# Altium project AL1000.PrjPcb (part 2 of 2)
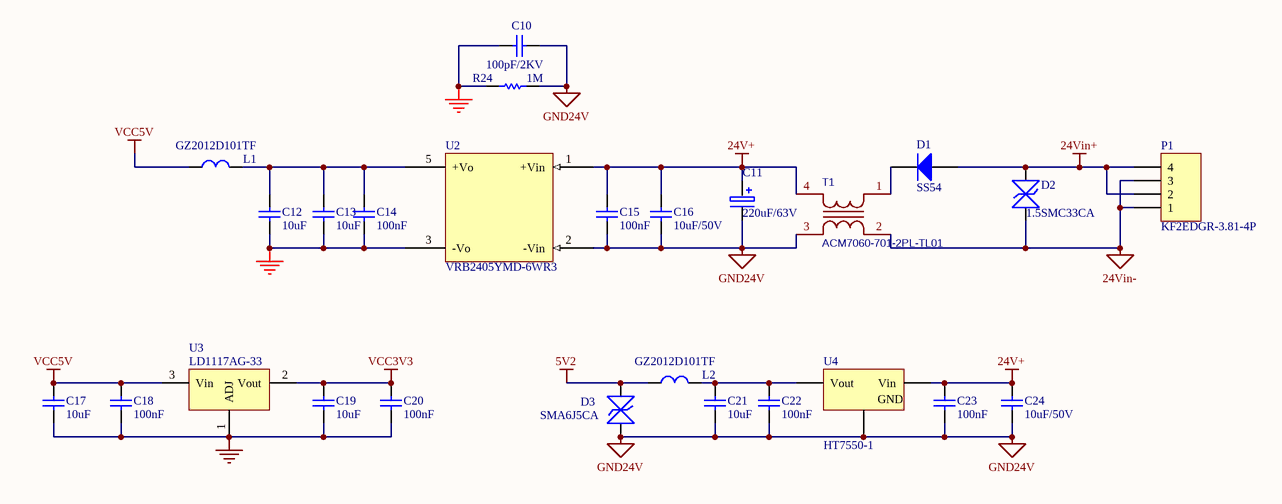
[diagram p7: POWER.SchDoc]

## Nets that join several sheets
5V2: 1 (C49_1.2 U13_1.8), relay (8 pins), POWER (D3.1 L2.2), 3 (C49_3.2 U13_3.8), 2 (C49_2.2 U13_2.8)
24V+: 1 (12 pins), relay (6 pins), POWER (8 pins), 3 (12 pins), 2 (12 pins)
GND: stm32 (34 pins), 1 (12 pins), relay (8 pins), uart (11 pins), EtherNet (16 pins), POWER (11 pins), 3 (12 pins), 2 (12 pins)
GND24V: AL1000 (18 pins), 1 (33 pins), relay (37 pins), uart (6 pins), EtherNet (P11.13 P11.14), POWER (13 pins), 3 (33 pins), 2 (33 pins)
VCC3V3: stm32 (25 pins), 1 (C48_1.2 L5_1.1 U13_1.1 U15_1.1), relay (10 pins), uart (5 pins), EtherNet (25 pins), POWER (C19.2 C20.2 U3.2), 3 (C48_3.2 L5_3.1 U13_3.1 U15_3.1), 2 (C48_2.2 L5_2.1 U13_2.1 U15_2.1)
VCC5V: stm32 (P2.6 P10.29), uart (7 pins), POWER (C17.2 C18.2 L1.2 U3.3)
NetC42_2_2: stm32 (D4.30), 2 (C42_2.2 R37_2.2)
NetC46_2_2: stm32 (D4.29), 2 (C46_2.2 R42_2.2)
NetD4_1: stm32 (D4.1), relay (U24.3)
NetD4_2: stm32 (D4.2), relay (U26.3)
NetD4_3: stm32 (D4.3), relay (U16.2)
NetD4_4: stm32 (D4.4), relay (U17.2)
NetD4_23: stm32 (D4.23), 1 (U13_1.3)
NetD4_24: stm32 (D4.24), EtherNet (R22.1 U1.34)
NetD4_25: stm32 (D4.25), EtherNet (R4.1 U1.30)
NetD4_26: stm32 (D4.26), 1 (U13_1.2)
NetD4_48: stm32 (D4.48), EtherNet (R11.2)
NetD4_51: stm32 (D4.51), EtherNet (R12.2)
NetD4_52: stm32 (D4.52), EtherNet (R13.2)
NetD4_53: stm32 (D4.53), EtherNet (R1.1 U1.7)
NetD4_55: stm32 (D4.55), EtherNet (R16.2)
NetD4_56: stm32 (D4.56), EtherNet (R14.2)
NetD4_57: stm32 (D4.57), EtherNet (R15.2)
NetD4_58: stm32 (D4.58), EtherNet (U1.29)
NetD4_59: stm32 (D4.59), relay (U20.2)
NetD4_60: stm32 (D4.60), relay (U22.2)
NetD4_61: stm32 (D4.61), relay (U24.2)
NetD4_62: stm32 (D4.62), relay (U26.2)
NetD4_67: stm32 (D4.67), EtherNet (R22.2)
NetD4_68: stm32 (D4.68), uart (R92.2)
NetD4_69: stm32 (D4.69), uart (R90.1)
NetD4_84: stm32 (D4.84), 2 (R67_2.1)
NetD4_85: stm32 (D4.85), 1 (R67_1.1)
NetD4_86: stm32 (D4.86), uart (R97.2)
NetD4_87: stm32 (D4.87), uart (R96.1)
NetD4_88: stm32 (D4.88), uart (R105.1)
NetD4_94: stm32 (D4.94), uart (R86.2 U27.3)
NetD4_97: stm32 (D4.97), relay (U20.3)
NetD4_98: stm32 (D4.98), relay (U22.3)
PC1: stm32 (D4.16), EtherNet (R3.1 U1.31)
PC2: stm32 (D4.17), 3 (C46_3.2 R42_3.2)
PC3: stm32 (D4.18), 3 (C42_3.2 R37_3.2)
PC4: stm32 (D4.33), 1 (C46_1.2 R42_1.2)
PC5: stm32 (D4.34), 1 (C42_1.2 R37_1.2)
PC6: stm32 (D4.63), 3 (U13_3.2)
PC7: stm32 (D4.64), 3 (U13_3.3)
PC8: stm32 (D4.65), 2 (U13_2.2)
PC9: stm32 (D4.66), 2 (U13_2.3)
PC10: stm32 (D4.78), uart (R102.2)
PC11: stm32 (D4.79), uart (R101.1)
PC13: stm32 (D4.7), 3 (R67_3.1)